# EAGLE design M_N_ext_connector (EAGLE 9.6.2)
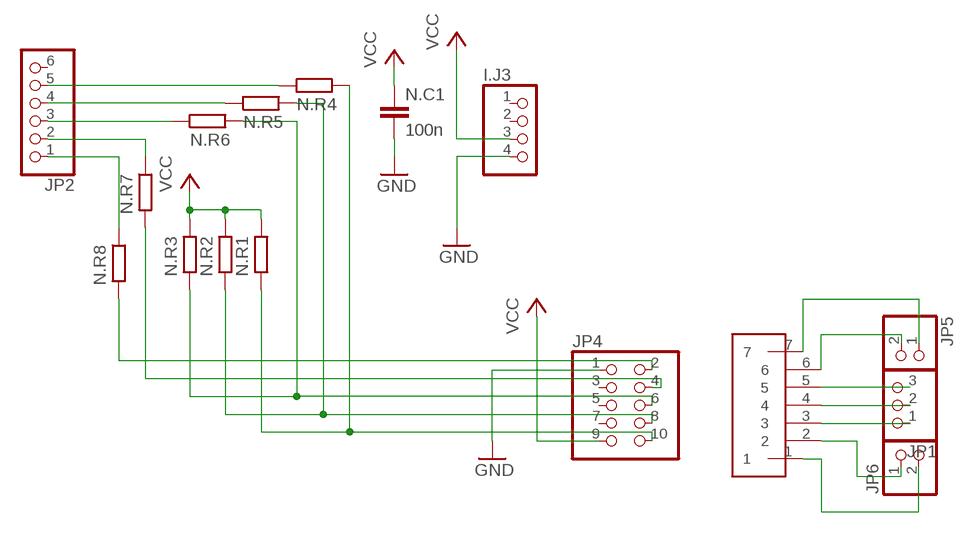
[diagram p0: schematic, sheet 1]

## Parts
I.J3  PINHD-1X4  [1X04]
JP1  PINHD-1X3  [1X03]
JP2  PINHD-1X6  [1X06]
JP4  PINHD-2X5/90  [2X05/90]
JP5  PINHD-1X2  [1X02]
JP6  PINHD-1X2  [1X02]
N.C1  100n  C-EUC0603  [C0603]
N.R1  4k7  R-EU_R0603  [R0603]
N.R2  4k7  R-EU_R0603  [R0603]
N.R3  4k7  R-EU_R0603  [R0603]
N.R4  4k7  R-EU_R0603  [R0603]
N.R5  4k7  R-EU_R0603  [R0603]
N.R6  4k7  R-EU_R0603  [R0603]
N.R7  4k7  R-EU_R0603  [R0603]
N.R8  4k7  R-EU_R0603  [R0603]
U$1  7PIN_CONNECTOR  [7PIN_CONNECTOR]

## Nets
GND: I.J3.4 JP4.1 N.C1.2
GND1: JP5.1 U$1.7
N$2: JP4.10 N.R1.2 N.R4.2
N$3: JP4.8 N.R2.2 N.R5.2
N$4: JP2.5 N.R4.1
N$5: JP2.4 N.R5.1
N$6: JP2.3 N.R6.1
N$7: JP2.2 N.R7.1
N$8: JP2.1 N.R8.1
N$9: JP4.6 N.R3.2 N.R6.2
N$10: JP4.4 N.R7.2
N$11: JP4.2 N.R8.2
PA3: JP6.1 U$1.2
PA6: JP1.1 U$1.3
PA7: JP1.2 U$1.4
SCL1: JP5.2 U$1.6
SDA1: JP1.3 U$1.5
VCC: I.J3.3 JP4.9 N.C1.1 N.R1.1 N.R2.1 N.R3.1
VCC1: JP6.2 U$1.1
Unconnected: I.J3.1 I.J3.2 JP2.6 JP4.3 JP4.5 JP4.7

## Library data of the parts
I.J3 = pinhead2:PINHD-1X4: PIN HEADER
JP1 = pinhead2:PINHD-1X3: PIN HEADER
JP2 = pinhead2:PINHD-1X6: PIN HEADER
JP4 = pinhead2:PINHD-2X5: PIN HEADER
JP5 JP6 = pinhead2:PINHD-1X2: PIN HEADER
N.C1 = rcl:C-EU: CAPACITOR, European symbol; SPICEPREFIX: C
N.R1-N.R8 = rcl:R-EU_: RESISTOR, European symbol; SPICEPREFIX: R
U$1 = hugo:7PIN_CONNECTOR

## Board
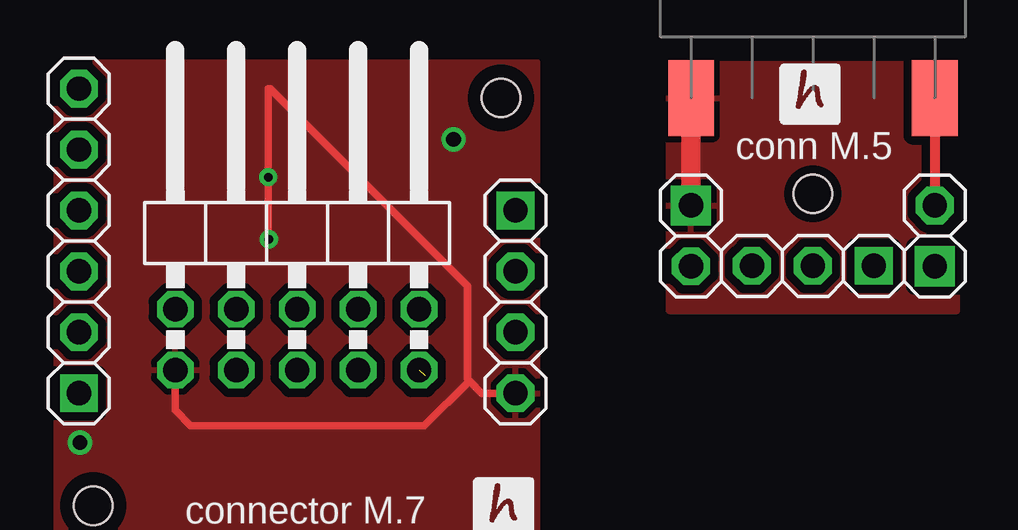
[diagram p1: board, top side]
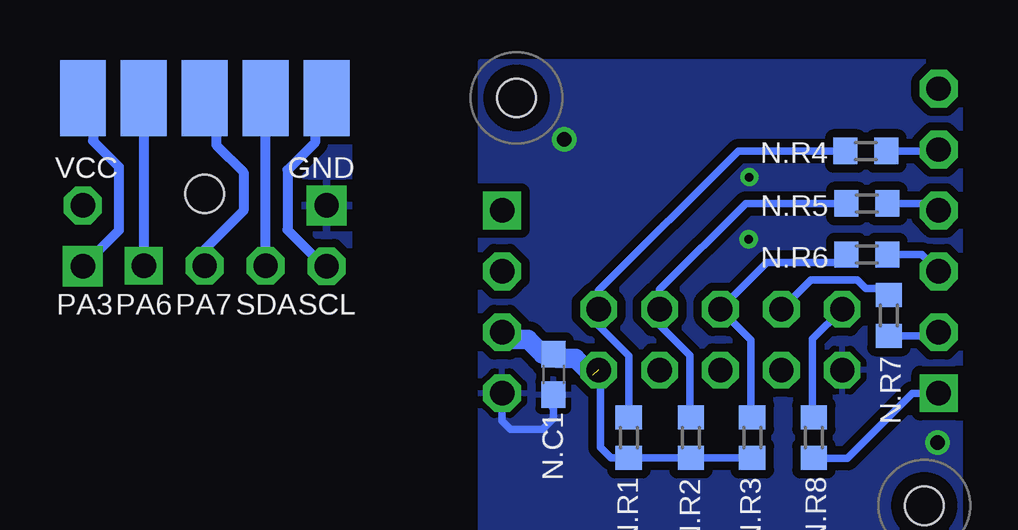
[diagram p2: board, bottom side, seen from below]

No outline drawn. Coordinates in mm, seen from the top.
Copper layers (1*16): Top 0.035mm / dielectric 1.5mm / Bottom 0.035mm
Design rules "default *": minimum track width 12mil, minimum drill 0.35mm, track to track 14mil, track to pad 12mil, pad to pad 14mil, via to via 14mil, smd to smd 14mil, copper to edge 15mil, drill to drill 15mil, minimum pad ring 10mil, minimum via ring 8mil, stop-mask expansion 4mil, vias tented up to drill 0mil, thermal gap 10mil
Holes 1.6 mm at 19,19 2,2 32,15
tRestrict: area 18,18 to 20,20; area 1,1 to 3,3
bRestrict: area 1,1 to 3,3; area 18,18 to 20,20

### Footprints (pad centres in the part's own frame; a part is rotated, then mirrored left to right if it is on the bottom)
1X04 = drill 1.016 pad 1.575 square: 1 -3.81,0 | drill 1.016 pad 1.575 octagon: 2 -1.27,0; 3 1.27,0; 4 3.81,0
1X03 = drill 1.016 pad 1.575 square: 1 -2.54,0 | drill 1.016 pad 1.575 octagon: 2 0,0; 3 2.54,0
1X06 = drill 1.016 pad 1.575 square: 1 -6.35,0 | drill 1.016 pad 1.575 octagon: 2 -3.81,0; 3 -1.27,0; 4 1.27,0; 5 3.81,0; 6 6.35,0
2X05/90 = drill 1.016 octagon: 1 -5.08,-6.35; 2 -5.08,-3.81; 3 -2.54,-6.35; 4 -2.54,-3.81; 5 0,-6.35; 6 0,-3.81; 7 2.54,-6.35; 8 2.54,-3.81; 9 5.08,-6.35; 10 5.08,-3.81
1X02 = drill 1.016 pad 1.676 square: 1 -1.27,0 | drill 1.016 pad 1.575 octagon: 2 1.27,0
C0603 = smd 1.1 x 1: 1 -0.85,0; 2 0.85,0
R0603 = smd 1 x 1.1: 1 -0.85,0; 2 0.85,0
7PIN_CONNECTOR = smd 3.175 x 1.905: 1 0,5.08; 7 0,-5.08 | smd 3.175 x 1.905 bottom: 2 0,5.08; 3 0,2.54; 4 0,0; 5 0,-2.54; 6 0,-5.08

### Placement (x,y rotation side)
I.J3  19.6,10.5 270 top
JP1  32,12 180 top
JP2  1.4,13.04 90 top
JP4  10.5,14 0 top
JP5  26.92,13.25 270 top
JP6  37.08,13.25 90 top
N.C1  17.46,7.47 270 bottom
N.R1  14.32,4.84 90 bottom
N.R2  11.73,4.84 90 bottom
N.R3  9.17,4.84 90 bottom
N.R4  4.44,16.79 180 bottom
N.R5  4.4,14.61 180 bottom
N.R6  4.4,12.47 180 bottom
N.R7  3.48,9.93 90 bottom
N.R8  6.6,4.84 90 bottom
U$1  32,19 270 top

### Tracks (layer width: path | path; a pad name or v marks a point on that pad's centre or on a via)
GND  (via drill 0.35, 0.61)
  Top 0.305: I.J3.4 18.2,6.69 17.68,7.21 | 17.68,7.21 17.59,7.29 17.59,11.16 9.36,19.39 9.3,19.39 v9.3,15.7 9.3,13.13 v9.32,13.11 | 17.68,7.21 15.8,5.33 6.07,5.33 5.42,5.99 JP4.1
  Bottom 0.305: 17.5,6.1 17.5,6.59 N.C1.2 17.46,5.63 17.91,5.18 19.25,5.18 19.6,5.53 I.J3.4
  other vias: 17.02,17.27 1.45,4.62
  pour Top (isolate 0.254): 0.47,20.5 20.5,20.5 20.5,0.5 0.47,0.5
  pour Bottom (isolate 0.254): 0.5,20.5 20.5,20.5 20.5,0.5 0.5,0.5
GND1
  Top 0.813: JP5.1 U$1.7
  pour Top (isolate 0.254): 26,20.42 38,20.42 38,10.1 26,10.1
  pour Bottom (isolate 0.254): 26,20.42 38,20.42 38,10.1 26,10.1
N$2
  Bottom 0.305: N.R4.2 9.75,16.79 15.58,10.96 JP4.10 15.58,9.5 14.32,8.24 N.R1.2
N$3
  Bottom 0.305: 11.62,5.81 N.R2.2 11.77,5.74 11.77,8.26 13.04,9.53 JP4.8 13.04,11.01 9.45,14.61 N.R5.2
N$4
  Bottom 0.305: N.R4.1 1.46,16.79 JP2.5
N$5
  Bottom 0.305: JP2.4 1.7,14.61 N.R5.1
N$6
  Bottom 0.305: N.R6.1 2.1,12.47 JP2.3
N$7
  Bottom 0.305: N.R7.1 1.68,9.08 1.53,9.23 JP2.2
N$8
  Bottom 0.305: JP2.1 2.49,6.69 5.2,3.98 N.R8.1
N$9
  Bottom 0.305: 5.53,12.47 N.R6.2 5.65,12.14 8.56,12.14 10.5,10.2 JP4.6 9.23,8.92 9.23,5.75 N.R3.2
N$10
  Bottom 0.305: 3.61,10.91 N.R7.2 3.76,11.06 4.45,11.06 4.79,11.41 6.74,11.41 JP4.4
N$11
  Bottom 0.305: JP4.2 6.67,8.95 6.67,5.76 N.R8.2
PA3
  Bottom 0.406: U$1.2 36.65,18.57 36.65,17.2 35.58,16.14 35.58,13.48 JP6.1
PA6
  Bottom 0.406: U$1.3 JP1.1
PA7
  Bottom 0.406: U$1.4 31.52,18.52 31.52,17.04 30.38,15.91 30.38,14.3 32,12.69 JP1.2
SCL1
  Bottom 0.305: U$1.6 26.92,17.68
  Bottom 0.406: U$1.6 27.4,18.52 27.4,17.14 28.55,16 28.55,13.5 27.03,11.98 JP5.2
SDA1
  Bottom 0.406: 29.62,18.62 U$1.5 29.48,18.98 29.48,12.03 JP1.3 29.62,12.16
VCC  (1 unrouted)
  Bottom 0.305: N.R3.1 11.66,3.99 11.7,3.96 N.R2.1 14.22,3.99 14.27,3.94 N.R1.1 15.06,3.99 15.5,4.44 15.5,7.57 JP4.9
  Bottom 0.813: I.J3.3 19.3,8.93 18.53,8.93 17.92,8.32 N.C1.1 17.29,8.14 16.54,8.14 15.83,7.44
VCC1
  Top 0.406: U$1.1 JP6.2

### Text on the board
tPlace: conn M.5 | connector M.7
bPlace: GND | VCC | SCL | SDA | PA7 | PA6 | PA3